# EAGLE design PiGateway2_2 (EAGLE 7.6.0)
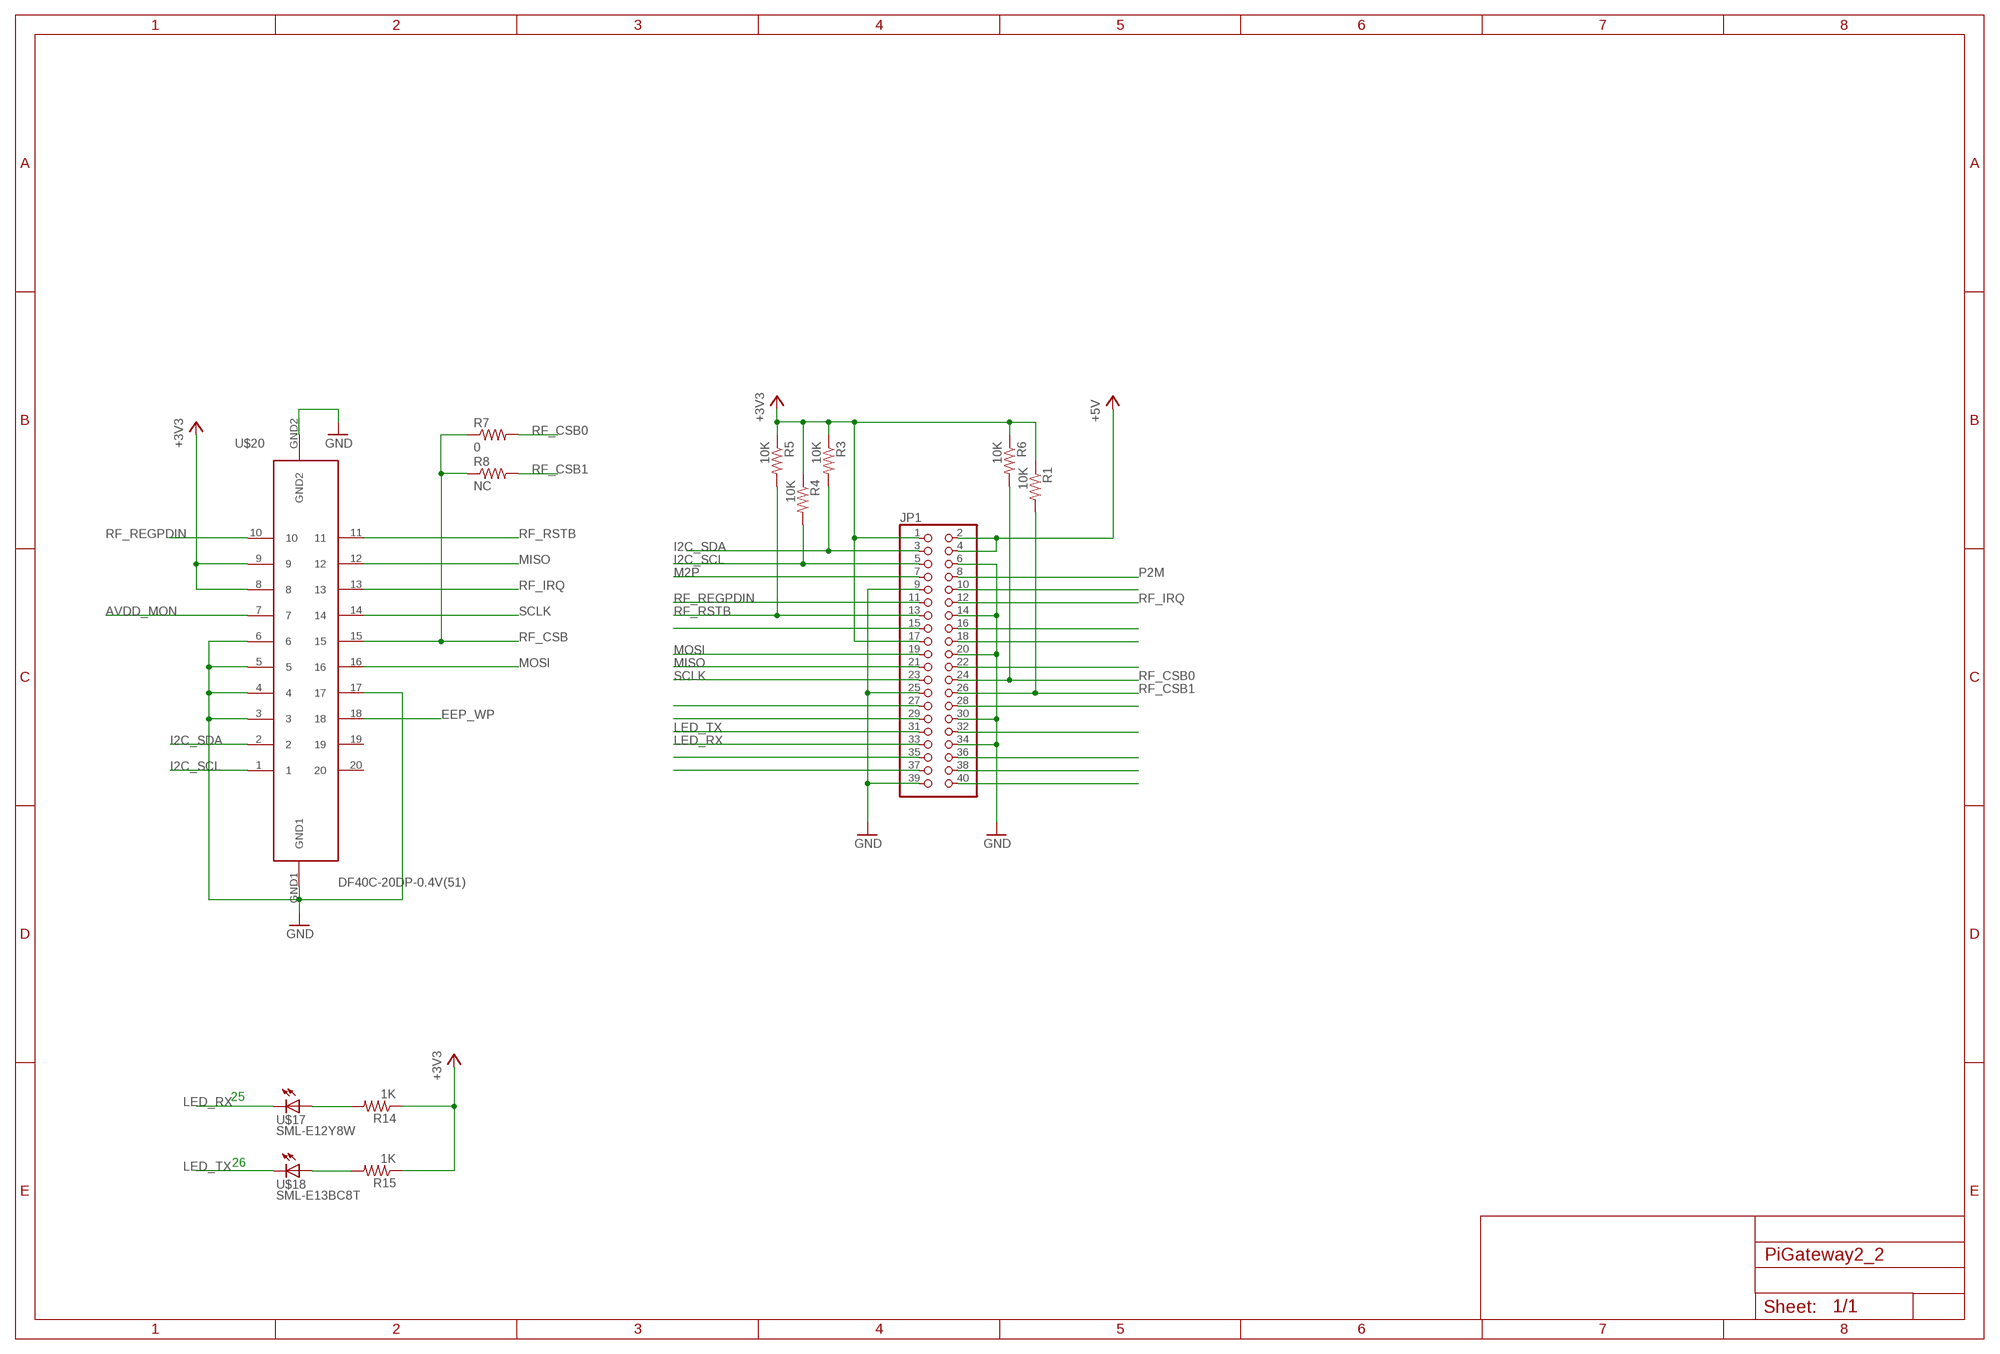
[diagram p0: schematic, sheet 1]

## Parts
JP1  PINHD-2X20  [2X20]
R1  10K  R-US_R0402  [R0402]
R3  10K  R-US_R0402  [R0402]
R4  10K  R-US_R0402  [R0402]
R5  10K  R-US_R0402  [R0402]
R6  10K  R-US_R0402  [R0402]
R7  0  R-US_R0402  [R0402]
R8  NC  R-US_R0402  [R0402]
R14  1K  R-US_R0402  [R0402]
R15  1K  R-US_R0402  [R0402]
U$17  SML-E12Y8W  SML-E1X  [SML-E1X]
U$18  SML-E13BC8T  SML-E1X  [SML-E1X]
U$20  DF40C-20DP-0.4V(51)  BP3596A  [BP3596A]

## Nets
+3V3: JP1.1 JP1.17 R1.1 R3.1 R4.1 R5.1 R6.1 R14.1 R15.1 U$20.8 U$20.9
+5V: JP1.2 JP1.4
AVDD_MON: U$20.7
EEP_WP: U$20.18
GND: JP1.6 JP1.9 JP1.14 JP1.20 JP1.25 JP1.30 JP1.34 JP1.39 U$20.3 U$20.4 U$20.5 U$20.6 U$20.17 U$20.GND1 U$20.GND2
I2C_SCL: JP1.5 R4.2 U$20.1
I2C_SDA: JP1.3 R3.2 U$20.2
LED_RX: JP1.33 U$17.C
LED_TX: JP1.31 U$18.C
M2P: JP1.7
MISO: JP1.21 U$20.12
MOSI: JP1.19 U$20.16
N$5: R14.2 U$17.A
N$6: R15.2 U$18.A
N$14: JP1.15
N$18: JP1.27
N$19: JP1.29
N$22: JP1.35
N$23: JP1.37
N$24: JP1.40
N$25: JP1.38
N$26: JP1.36
N$27: JP1.32
N$28: JP1.28
N$31: JP1.22
N$32: JP1.18
N$33: JP1.16
N$35: JP1.10
P2M: JP1.8
RF_CSB: R7.1 R8.1 U$20.15
RF_CSB0: JP1.24 R6.2 R7.2
RF_CSB1: JP1.26 R1.2 R8.2
RF_IRQ: JP1.12 U$20.13
RF_REGPDIN: JP1.11 U$20.10
RF_RSTB: JP1.13 R5.2 U$20.11
SCLK: JP1.23 U$20.14
Unconnected: U$20.19 U$20.20

## Notes on the sheet
- 25
- 26

## Library data of the parts
JP1 = pinhead:PINHD-2X20: PIN HEADER
R1 R3-R8 R14 R15 = rcl:R-US_: RESISTOR, American symbol
U$17 U$18 = lazurite:SML-E1X
U$20 = lazurite:BP3596A

## Board
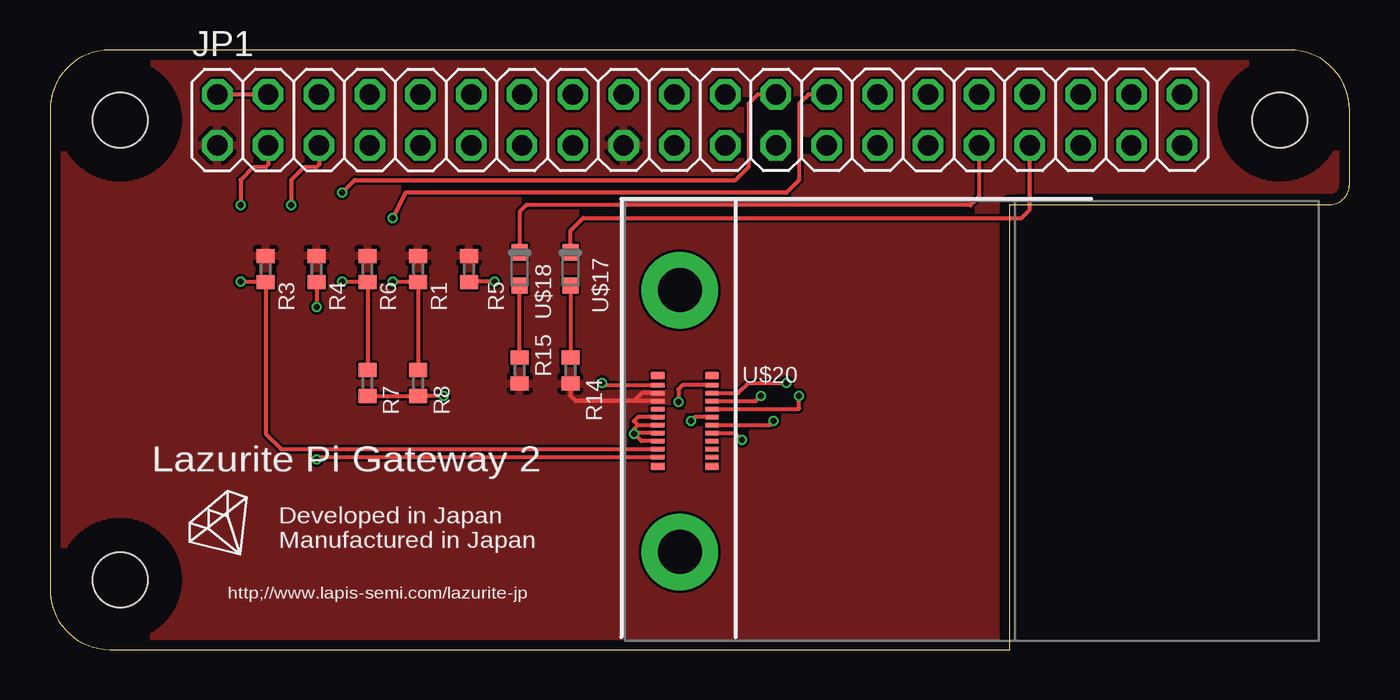
[diagram p1: board, top side]
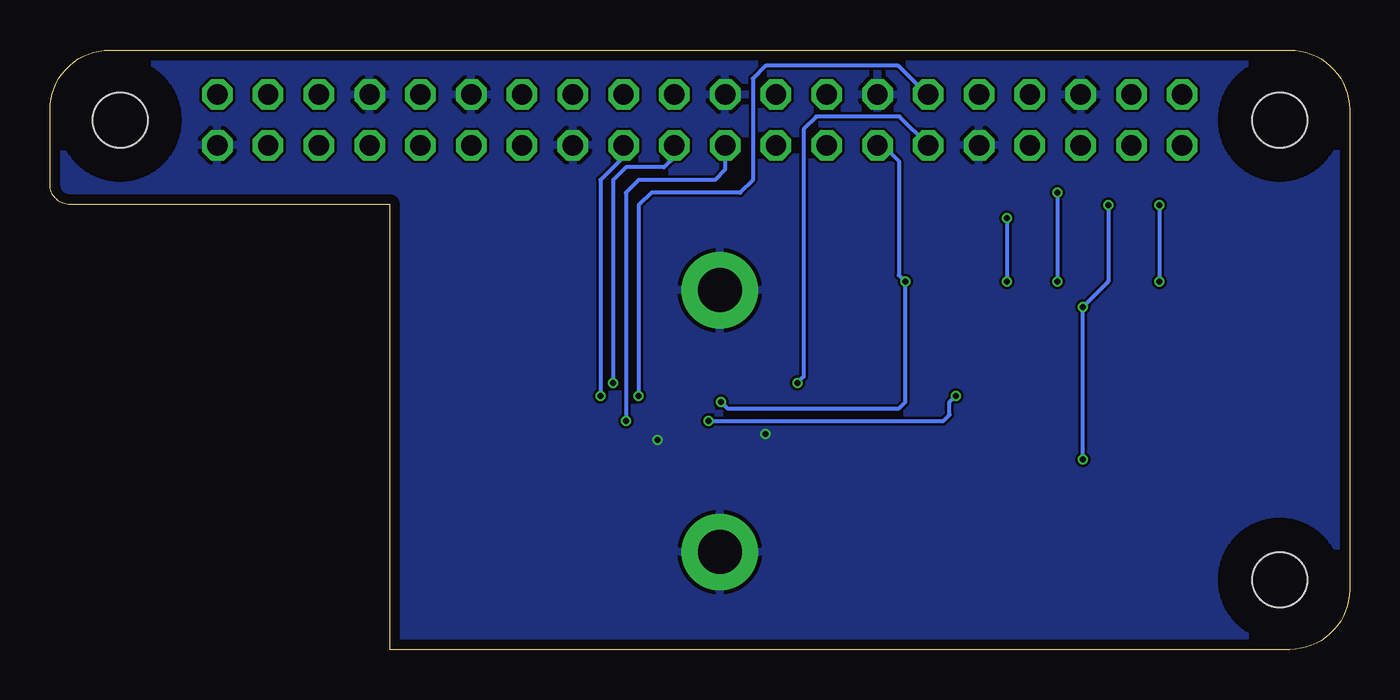
[diagram p2: board, bottom side, seen from below]

Size 65 x 30 mm. Coordinates in mm from the lower left corner, seen from the top.
Outline: 0,3 arc90 3,0 48,0 48,22.27 64,22.27 arc90 65,23.27 65,27 arc90 62,30 3,30 arc90 0,27 0,3
Copper layers (1*16): Top 0.018mm / dielectric 1.55mm / Bottom 0.018mm
Design rules "unicraft_2layer": minimum track width 0.125mm, minimum drill 0.25mm, track to track 0.125mm, track to pad 0.125mm, pad to pad 0.125mm, via to via 0.125mm, smd to smd 0mil, copper to edge 0.5mm, drill to drill 0.3mm, minimum pad ring 0.175mm, minimum via ring 0.1mm, stop-mask expansion 0mil, vias tented up to drill 0.45mm, thermal gap 0.2mm
Holes 2.75 mm at 3.5,26.5 3.5,3.5 61.5,26.5
tRestrict: area 0.5,23.5 to 6.5,29.5; area 0.5,0.5 to 6.5,6.5; area 58.5,23.5 to 64.5,29.5
bRestrict: area 0.5,0.5 to 6.5,6.5; area 0.5,23.5 to 6.5,29.5; area 58.5,23.5 to 64.5,29.5

### Footprints (pad centres in the part's own frame; a part is rotated, then mirrored left to right if it is on the bottom)
2X20 = drill 1.016 octagon: 1 -24.13,-1.27; 2 -24.13,1.27; 3 -21.59,-1.27; 4 -21.59,1.27; 5 -19.05,-1.27; 6 -19.05,1.27; 7 -16.51,-1.27; 8 -16.51,1.27; 9 -13.97,-1.27; 10 -13.97,1.27; 11 -11.43,-1.27; 12 -11.43,1.27; 13 -8.89,-1.27; 14 -8.89,1.27; 15 -6.35,-1.27; 16 -6.35,1.27; 17 -3.81,-1.27; 18 -3.81,1.27; 19 -1.27,-1.27; 20 -1.27,1.27; 21 1.27,-1.27; 22 1.27,1.27; 23 3.81,-1.27; 24 3.81,1.27; 25 6.35,-1.27; 26 6.35,1.27; 27 8.89,-1.27; 28 8.89,1.27; 29 11.43,-1.27; 30 11.43,1.27; 31 13.97,-1.27; 32 13.97,1.27; 33 16.51,-1.27; 34 16.51,1.27; 35 19.05,-1.27; 36 19.05,1.27; 37 21.59,-1.27; 38 21.59,1.27; 39 24.13,-1.27; 40 24.13,1.27
R0402 = smd 0.7 x 0.9: 1 -0.65,0; 2 0.65,0
SML-E1X = smd 0.8 x 0.8: A 0,-0.825; C 0,0.825
BP3596A = smd 0.23 x 0.66: 1 1.8,-1.355; 2 1.4,-1.355; 3 1,-1.355; 4 0.6,-1.355; 5 0.2,-1.355; 6 -0.2,-1.355; 7 -0.6,-1.355; 8 -1,-1.355; 9 -1.4,-1.355; 10 -1.8,-1.355; 11 -1.8,1.355; 12 -1.4,1.355; 13 -1,1.355; 14 -0.6,1.355; 15 -0.2,1.355; 16 0.2,1.355; 17 0.6,1.355; 18 1,1.355; 19 1.4,1.355; 20 1.8,1.355 | drill 2.2 pad 3.81: GND1 6.55,-0.25; GND2 -6.55,-0.25 | smd 0.35 x 0.66: NC1 2.275,-1.355; NC2 -2.275,-1.355; NC3 -2.275,1.355; NC4 2.275,1.355

### Placement (x,y rotation side)
JP1  32.5,26.5 0 top
R1  18.41,19.05 270 top
R3  10.79,19.05 270 top
R4  13.34,19.05 270 top
R5  20.95,19.05 270 top
R6  15.88,19.05 270 top
R7  15.88,13.34 90 top
R8  18.41,13.34 90 top
R14  26.04,13.97 90 top
R15  23.5,13.97 90 top
U$1  [LOGO]  6.35,5.08 0 top
U$17  26.04,19.05 0 top
U$18  23.5,19.05 0 top
U$20  31.75,11.43 270 top

### Tracks (layer width: path | path; a pad name or v marks a point on that pad's centre or on a via)
+3V3
  Top 0.2: U$20.8 29.21,12.43 | 29.21,12.43 26.3,12.43 26.04,12.7 R14.1 | U$20.9 29.61,12.83 29.21,12.43
  Top 0.406: JP1.1 8.26,25.23
  pour Top: 0.5,29.5 64.5,29.5 64.5,23 48.19,23 48.19,0.5 0.5,0.5
+5V
  Top 0.2: JP1.4 JP1.2
GND  (via drill 0.3)
  Top 0.2: U$20.6 29.41,11.63 29.21,11.43 29.41,11.23 | 29.41,11.23 U$20.5 | U$20.17 34.26,10.83 v34.61,10.48 | v29.21,10.79 29.21,11.03 29.41,11.23 | U$20.3 29.57,10.43 v29.21,10.79 | U$20.4 29.25,10.83 v29.21,10.79
  pour Bottom: 0.5,29.5 64.5,29.5 64.5,23 48.19,23 48.19,0.5 0.5,0.5
I2C_SCL  (via drill 0.3)
  Top 0.2: JP1.5 13.45,24.25 13.34,24.13 12.7,24.13 12.06,23.5 v12.06,22.23 | R4.2 v13.34,17.14 | v13.34,9.53 13.44,9.63 U$20.1
  Bottom 0.2: v12.06,22.23 12.06,18.41 v13.34,17.14 v13.34,9.53
I2C_SDA  (via drill 0.3)
  Top 0.2: JP1.3 10.91,24.25 10.79,24.13 10.16,24.13 9.53,23.5 v9.53,22.23 | v9.53,18.41 10.78,18.41 R3.2 10.79,10.79 11.56,10.03 U$20.2
  Bottom 0.2: v9.53,22.23 v9.53,18.41
LED_RX
  Top 0.2: U$17.C 26.04,20.95 26.67,21.59 48.58,21.59 49.01,22.02 JP1.33
LED_TX
  Top 0.2: JP1.31 46.47,22.66 46.04,22.23 23.81,22.23 23.5,21.91 U$18.C
MISO  (via drill 0.3)
  Top 0.2: U$20.12 34.42,12.83 34.92,13.34 v36.83,13.34
  Bottom 0.2: JP1.21 33.77,24.65 34.29,24.13 36.2,24.13 36.83,23.5 v36.83,13.34
MOSI  (via drill 0.3)
  Top 0.2: U$20.16 35.99,11.23 v36.2,11.43
  Bottom 0.2: JP1.19 31.23,24.02 31.75,23.5 35.56,23.5 36.2,22.86 v36.2,11.43
N$5
  Top 0.2: U$17.A R14.2
N$6
  Top 0.2: R15.2 U$18.A
RF_CSB  (via drill 0.3)
  Top 0.2: R7.1 R8.1 18.43,12.7 v19.68,12.7 | U$20.15 32.27,11.63 v32.07,11.43
  Bottom 0.2: v32.07,11.43 20.32,11.43 20,11.75 20,12.38 v19.68,12.7
RF_CSB0  (via drill 0.3)
  Top 0.2: JP1.24 35.39,27.77 34.92,27.3 34.92,24.13 34.29,23.5 15.24,23.5 v14.61,22.86 | R6.2 15.89,18.41 | v14.61,18.41 15.86,18.41 R6.2 | R6.2 R7.2
  Bottom 0.2: v14.61,22.86 v14.61,18.41
RF_CSB1  (via drill 0.3)
  Top 0.2: JP1.26 37.93,27.77 37.47,27.3 37.47,23.5 36.83,22.86 17.78,22.86 v17.14,21.59 | R8.2 R1.2 18.4,18.41 v17.14,18.41
  Bottom 0.2: v17.14,21.59 v17.14,18.41
RF_IRQ  (via drill 0.3)
  Top 0.2: U$20.13 35.29,12.43 v35.56,12.7
  Bottom 0.2: JP1.12 21.12,27.77 22.57,29.21 29.21,29.21 29.84,28.57 29.84,23.5 30.48,22.86 34.92,22.86 35.56,22.23 v35.56,12.7
RF_REGPDIN  (via drill 0.3)
  Top 0.2: v27.62,13.34 27.73,13.23 U$20.10
  Bottom 0.2: JP1.11 22.51,26.67 26.67,26.67 27.3,26.04 27.3,13.65 v27.62,13.34
RF_RSTB  (via drill 0.3)
  Top 0.2: v22.23,18.41 20.97,18.41 R5.2 | U$20.11 31.64,13.23 31.43,13.02 v31.43,12.38
  Bottom 0.2: JP1.13 23.32,25.23 22.54,24.45 22.54,18.73 v22.23,18.41 22.23,12.38 22.54,12.06 31.11,12.06 v31.43,12.38
SCLK  (via drill 0.3)
  Top 0.2: U$20.14 37.43,12.03 37.47,12.06 v37.47,12.7
  Bottom 0.2: JP1.23 36.31,24.65 37.47,23.5 v37.47,12.7

### Text on the board
tPlace: Lazurite Pi Gateway 2 | Developed in Japan / Manufactured in Japan | http;//www.lapis-semi.com/lazurite-jp